# EAGLE design psu_switch (EAGLE 7.6.0)
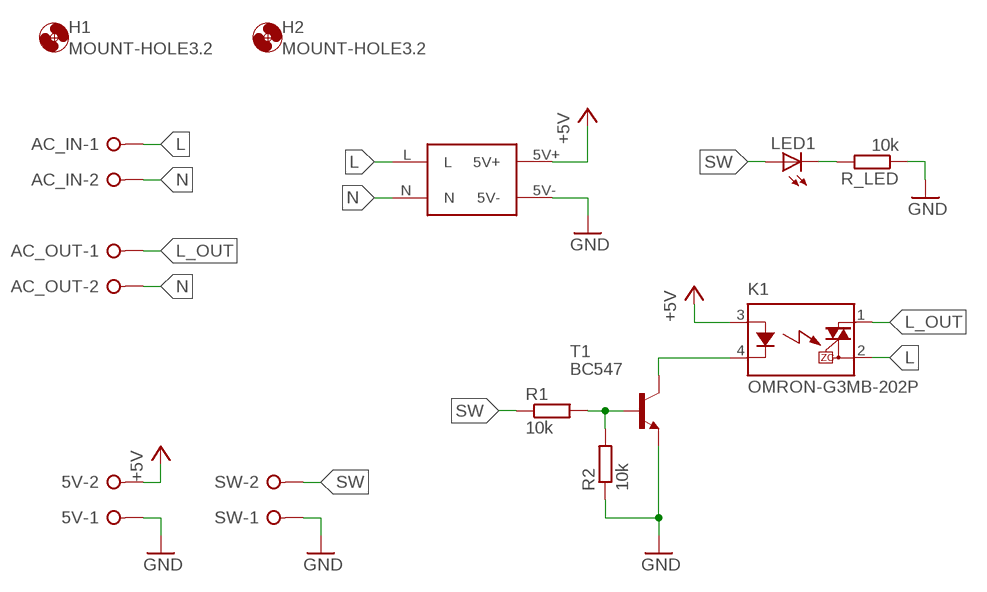
[diagram p0: schematic, sheet 1]

## Parts
5V  W237-02P  [W237-132]
AC_IN  W237-02P  [W237-132]
AC_OUT  W237-02P  [W237-132]
H1  MOUNT-HOLE3.2  [3,2]
H2  MOUNT-HOLE3.2  [3,2]
K1  OMRON-G3MB-202P  OMRON-G3MB-202P-SSR  [OMRON-G3MB-202P-SSR]
LED1  LED3MM  [LED3MM]
R1  10k  R-EU_0207/10  [0207/10]
R2  10k  R-EU_0207/10  [0207/10]
R_LED  10k  R-EU_0207/10  [0207/10]
SW  W237-02P  [W237-132]
T1  BC547  [TO92]
U$1  700MA-STEP-DOWN  [700MA-STEP-DOWN]

## Nets
+5V: 5V.2 K1.3(A) U$1.5V+
GND: 5V.1 R2.1 R_LED.1 SW.1 T1.1(E) U$1.5V-
L: AC_IN.1 K1.2(DS2) U$1.L
L_OUT: AC_OUT.1 K1.1(DS1)
N: AC_IN.2 AC_OUT.2 U$1.N
N$1: LED1.K(C) R_LED.2
N$5: K1.4(K) T1.3(C)
SW: LED1.A R1.1 SW.2
SW+: R1.2 R2.2 T1.2(B)

## Library data of the parts
5V AC_IN AC_OUT SW = con-wago-508:W237-02P: WAGO SREW CLAMP; OC_FARNELL: unknown; OC_NEWARK: unknown
H1 H2 = holes:MOUNT-HOLE: MOUNTING HOLE with drill center marker
K1 = Omron G3MB 202p SSR:OMRON-G3MB-202P-SSR: IT(rms) 8A, Zero Cross type SIP 4pin Triac output SSR Source: http://sharp-world.com/products/device/lineup/data/pdf/datasheet/s102s02_e.pdf
LED1 = led:LED: LED OSRAM: - CHIPLED LG R971, LG N971, LY N971, LG Q971, LY Q971, LO R971, LY R971 LH N974, LH R974 LS Q976, LO Q976, LY Q976 LO Q996 - Hyper CHIPLED LW Q18S LB Q993, LB Q99A, LB R99A - SideLED LS A670, LO A670, LY A670, LG A670, LP A670 LB A673, LV A673, LT A673, LW A673 LH A674 LY A675 LS A676, LA A676, LO A676, LY A676, LW A676 LS A679, LY A679, LG A679 - Hyper Micro SIDELED® LS Y876, LA Y876, LO Y876, LY Y876 LT Y87S - SmartLED LW L88C, LW L88S LB L89C, LB L89S, LG L890 LS L89K, LO L89K, LY L89K LS L896, LA L896, LO L896, LY L896 - TOPLED LS T670, LO T670, LY T670, LG T670, LP T670 LSG T670, LSP T670, LSY T670, LOP T670, LYG T670 LG T671, LOG T671, LSG T671 LB T673, LV T673, LT T673, LW T673 LH T674 LS T676, LA T676, LO T676, LY T676, LB T676, LH T676, LSB T676, LW T676 LB T67C, LV T67C, LT T67C, LS T67K, LO T67K, LY T67K, LW E67C LS E67B, LA E67B, LO E67B, LY E67B, LB E67C, LV E67C, LT E67C LW T67C LS T679, LY T679, LG T679 LS T770, LO T770, LY T770, LG T770, LP T770 LB T773, LV T773, LT T773, LW T773 LH T774 LS E675, LA E675, LY E675, LS T675 LS T776, LA T776, LO T776, LY T776, LB T776 LHGB T686 LT T68C, LB T68C - Hyper Mini TOPLED® LB M676 - Mini TOPLED Santana® LG M470 LS M47K, LO M47K, LY M47K Source: http://www.osram.convergy.de LUXEON: - LUMILED® LXK2-PW12-R00, LXK2-PW12-S00, LXK2-PW14-U00, LXK2-PW14-V00 LXK2-PM12-R00, LXK2-PM12-S00, LXK2-PM14-U00 LXK2-PE12-Q00, LXK2-PE12-R00, LXK2-PE12-S00, LXK2-PE14-T00, LXK2-PE14-U00 LXK2-PB12-K00, LXK2-PB12-L00, LXK2-PB12-M00, LXK2-PB14-N00, LXK2-PB14-P00, LXK2-PB14-Q00 LXK2-PR12-L00, LXK2-PR12-M00, LXK2-PR14-Q00, LXK2-PR14-R00 LXK2-PD12-Q00, LXK2-PD12-R00, LXK2-PD12-S00 LXK2-PH12-R00, LXK2-PH12-S00 LXK2-PL12-P00, LXK2-PL12-Q00, LXK2-PL12-R00 Source: www.luxeon.com KINGBRIGHT: KA-3528ASYC Source: www.kingbright.com
R1 R2 R_LED = resistor:R-EU_: RESISTOR, European symbol
T1 = transistor:BC547: NPN TRANSISTOR
U$1 = 700ma-step-down:700MA-STEP-DOWN

## Board
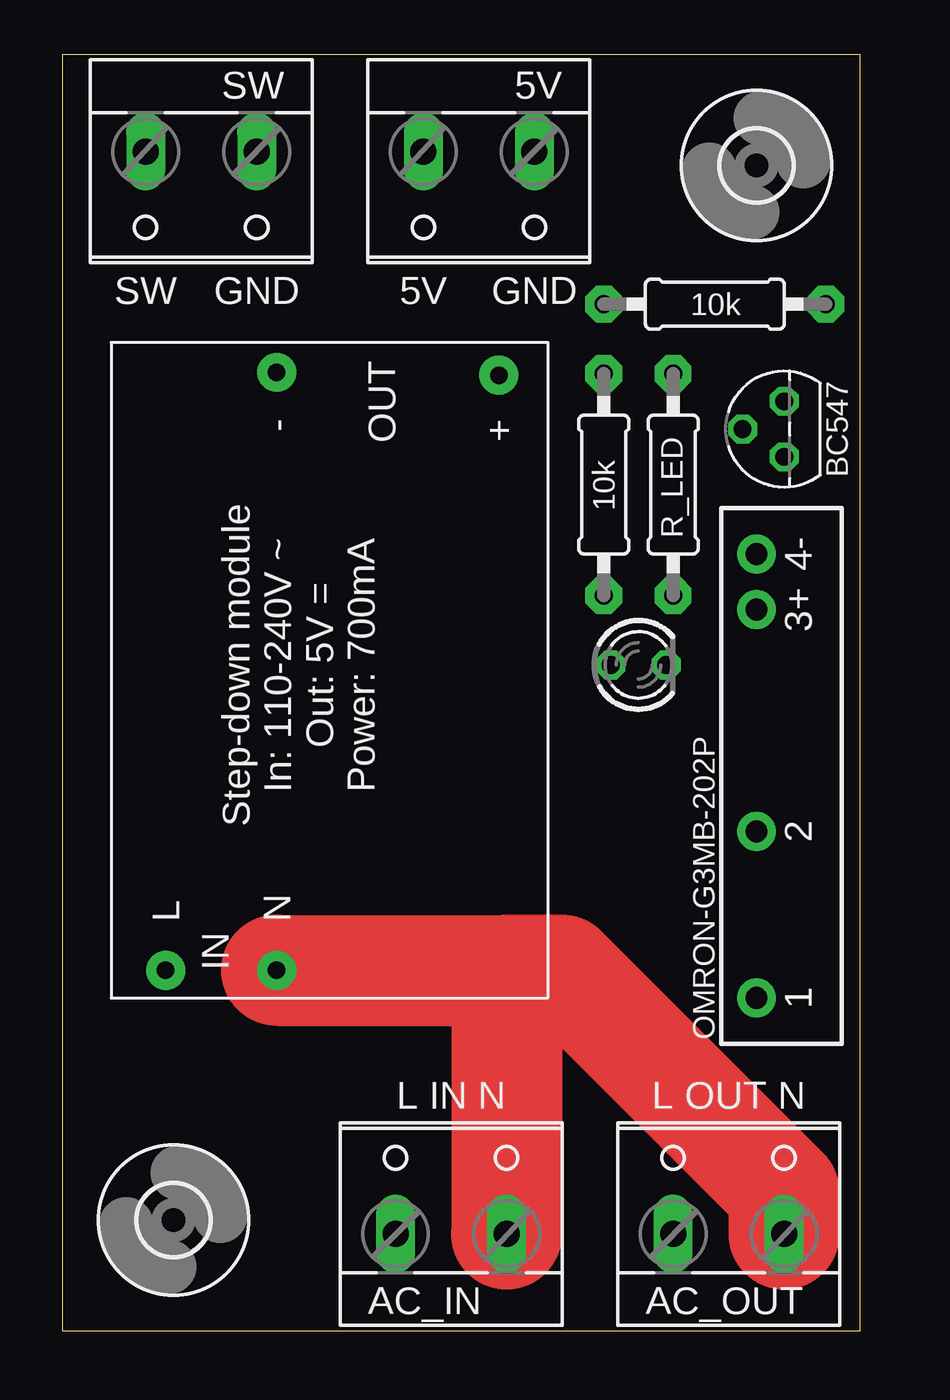
[diagram p1: board, top side]
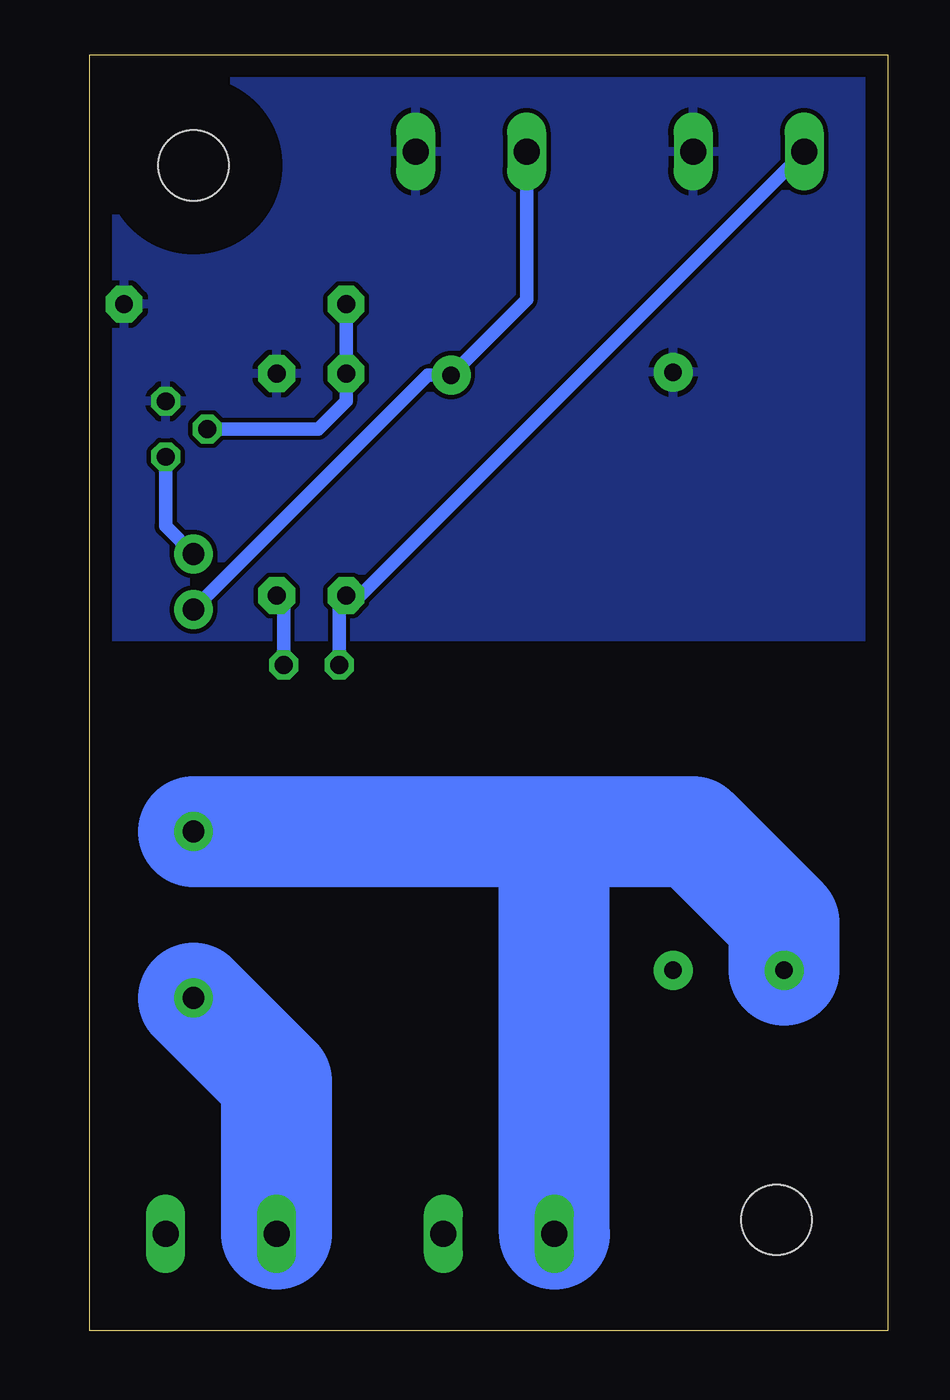
[diagram p2: board, bottom side, seen from below]

Size 36.5 x 58.41 mm. Coordinates in mm from the lower left corner, seen from the top.
Outline: 0,0 36.5,0 36.5,58.41 0,58.41 0,0
Copper layers (1*16): Top 0.035mm / dielectric 1.5mm / Bottom 0.035mm
Design rules "default": minimum track width 10mil, minimum drill 24mil, track to track 8mil, track to pad 8mil, pad to pad 8mil, via to via 8mil, smd to smd 8mil, copper to edge 40mil, drill to drill 8mil, minimum pad ring 10mil, minimum via ring 8mil, stop-mask expansion 4mil, vias tented up to drill 0mil, thermal gap 10mil

### Footprints (pad centres in the part's own frame; a part is rotated, then mirrored left to right if it is on the bottom)
W237-132 = drill 1.194 long: 1 -2.54,-0.635; 2 2.54,-0.635
3,2 = hole 3.2: 0,0
OMRON-G3MB-202P-SSR = drill 1 pad 1.778: 1 -10.16,0; 2 -2.54,0; 3 7.62,0; 4 10.16,0
LED3MM = drill 0.813 octagon: A -1.27,0; K 1.27,0
0207/10 = drill 0.813 pad 1.676 octagon: 1 -5.08,0; 2 5.08,0
TO92 = drill 0.813 octagon: 1 1.27,0; 2 0,1.905; 3 -1.27,0
700MA-STEP-DOWN = drill 0.8 pad 1.778: 5V+ 28.5,2.26; 5V- 28.63,12.42; L 1.27,17.5; N 1.27,12.42

### Placement (x,y rotation side)
5V  19.05,53.34 180 top
AC_IN  17.78,5.08 0 top
AC_OUT  30.48,5.08 0 top
H1  31.75,53.34 0 top
H2  5.08,5.08 0 top
K1  31.75,25.4 90 top
LED1  26.35,30.48 0 top
R1  24.77,38.73 90 top
R2  29.84,46.99 180 top
R_LED  27.94,38.73 270 top
SW  6.35,53.34 180 top
T1  33.02,41.27 90 top
U$1  22.23,15.24 90 top

### Tracks (layer width: path | path; a pad name or v marks a point on that pad's centre or on a via)
+5V
  Bottom 0.61: 5V.2 16.51,47.2 U$1.5V+ 21.03,43.74 K1.3
GND
  pour Bottom: -1.27,58.42 -1.27,31.75 36.83,31.75 36.83,58.42
L
  Bottom 5.08: U$1.L 4.72,18.7 8.89,22.86 15.24,22.86 | K1.2 15.24,22.86 | AC_IN.1 15.24,22.86
L_OUT
  Bottom 5.08: AC_OUT.1 27.94,11.43 K1.1
N
  Top 5.08: U$1.N 20.32,16.51 | 20.32,16.51 AC_IN.2 | AC_OUT.2 33.02,6.35 22.86,16.51 20.32,16.51
N$1
  Bottom 0.61: LED1.K 27.62,33.34 R_LED.2
N$5
  Bottom 0.61: T1.3 33.02,36.83 K1.4
SW
  Bottom 0.61: SW.2 24.13,33.66 R1.1 25.08,33.34 LED1.A
SW+
  Bottom 0.61: R2.2 R1.2 24.77,42.55 26.04,41.27 T1.2

### Text on the board
tNames: SW | GND | 5V | GND | L IN N | L OUT N